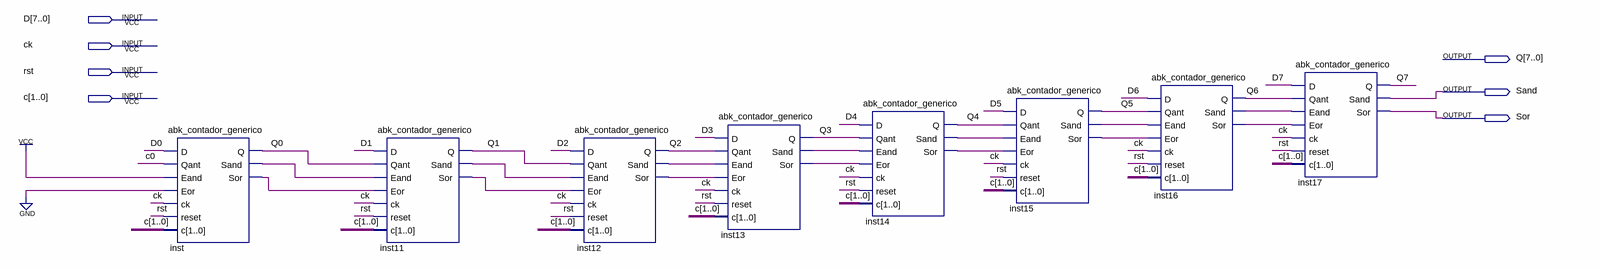
[diagram p0: schematic sheet]
// Quartus schematic abk_contador8bits.bdf as structural Verilog: 8 symbols, 7 pins
module abk_contador8bits (
  input  [7:0] D,
  input  ck,
  input  rst,
  input  [1:0] c,
  output [7:0] Q,
  output Sand,
  output Sor
);

  wire inst11_sand, inst11_sor, inst12_sand, inst12_sor, inst13_sand, inst13_sor, inst14_sand, inst14_sor,
       inst15_sand, inst15_sor, inst16_sand, inst16_sor, inst_sand, inst_sor;

  abk_contador_generico inst (
    .D(D[0]), .Qant(c[0]), .Eand(1'b1), .Eor(1'b0), .ck(ck), .reset(rst), .c(c), .Q(Q[0]), .Sand(inst_sand),
    .Sor(inst_sor));
  abk_contador_generico inst11 (
    .D(D[1]), .Qant(Q[0]), .Eand(inst_sand), .Eor(inst_sor), .ck(ck), .reset(rst), .c(c), .Q(Q[1]),
    .Sand(inst11_sand), .Sor(inst11_sor));
  abk_contador_generico inst12 (
    .D(D[2]), .Qant(Q[1]), .Eand(inst11_sand), .Eor(inst11_sor), .ck(ck), .reset(rst), .c(c), .Q(Q[2]),
    .Sand(inst12_sand), .Sor(inst12_sor));
  abk_contador_generico inst13 (
    .D(D[3]), .Qant(Q[2]), .Eand(inst12_sand), .Eor(inst12_sor), .ck(ck), .reset(rst), .c(c), .Q(Q[3]),
    .Sand(inst13_sand), .Sor(inst13_sor));
  abk_contador_generico inst14 (
    .D(D[4]), .Qant(Q[3]), .Eand(inst13_sand), .Eor(inst13_sor), .ck(ck), .reset(rst), .c(c), .Q(Q[4]),
    .Sand(inst14_sand), .Sor(inst14_sor));
  abk_contador_generico inst15 (
    .D(D[5]), .Qant(Q[4]), .Eand(inst14_sand), .Eor(inst14_sor), .ck(ck), .reset(rst), .c(c), .Q(Q[5]),
    .Sand(inst15_sand), .Sor(inst15_sor));
  abk_contador_generico inst16 (
    .D(D[6]), .Qant(Q[5]), .Eand(inst15_sand), .Eor(inst15_sor), .ck(ck), .reset(rst), .c(c), .Q(Q[6]),
    .Sand(inst16_sand), .Sor(inst16_sor));
  abk_contador_generico inst17 (
    .D(D[7]), .Qant(Q[6]), .Eand(inst16_sand), .Eor(inst16_sor), .ck(ck), .reset(rst), .c(c), .Q(Q[7]),
    .Sand(Sand), .Sor(Sor));
endmodule
